# EAGLE design smdkelvin004 (EAGLE 5.03)
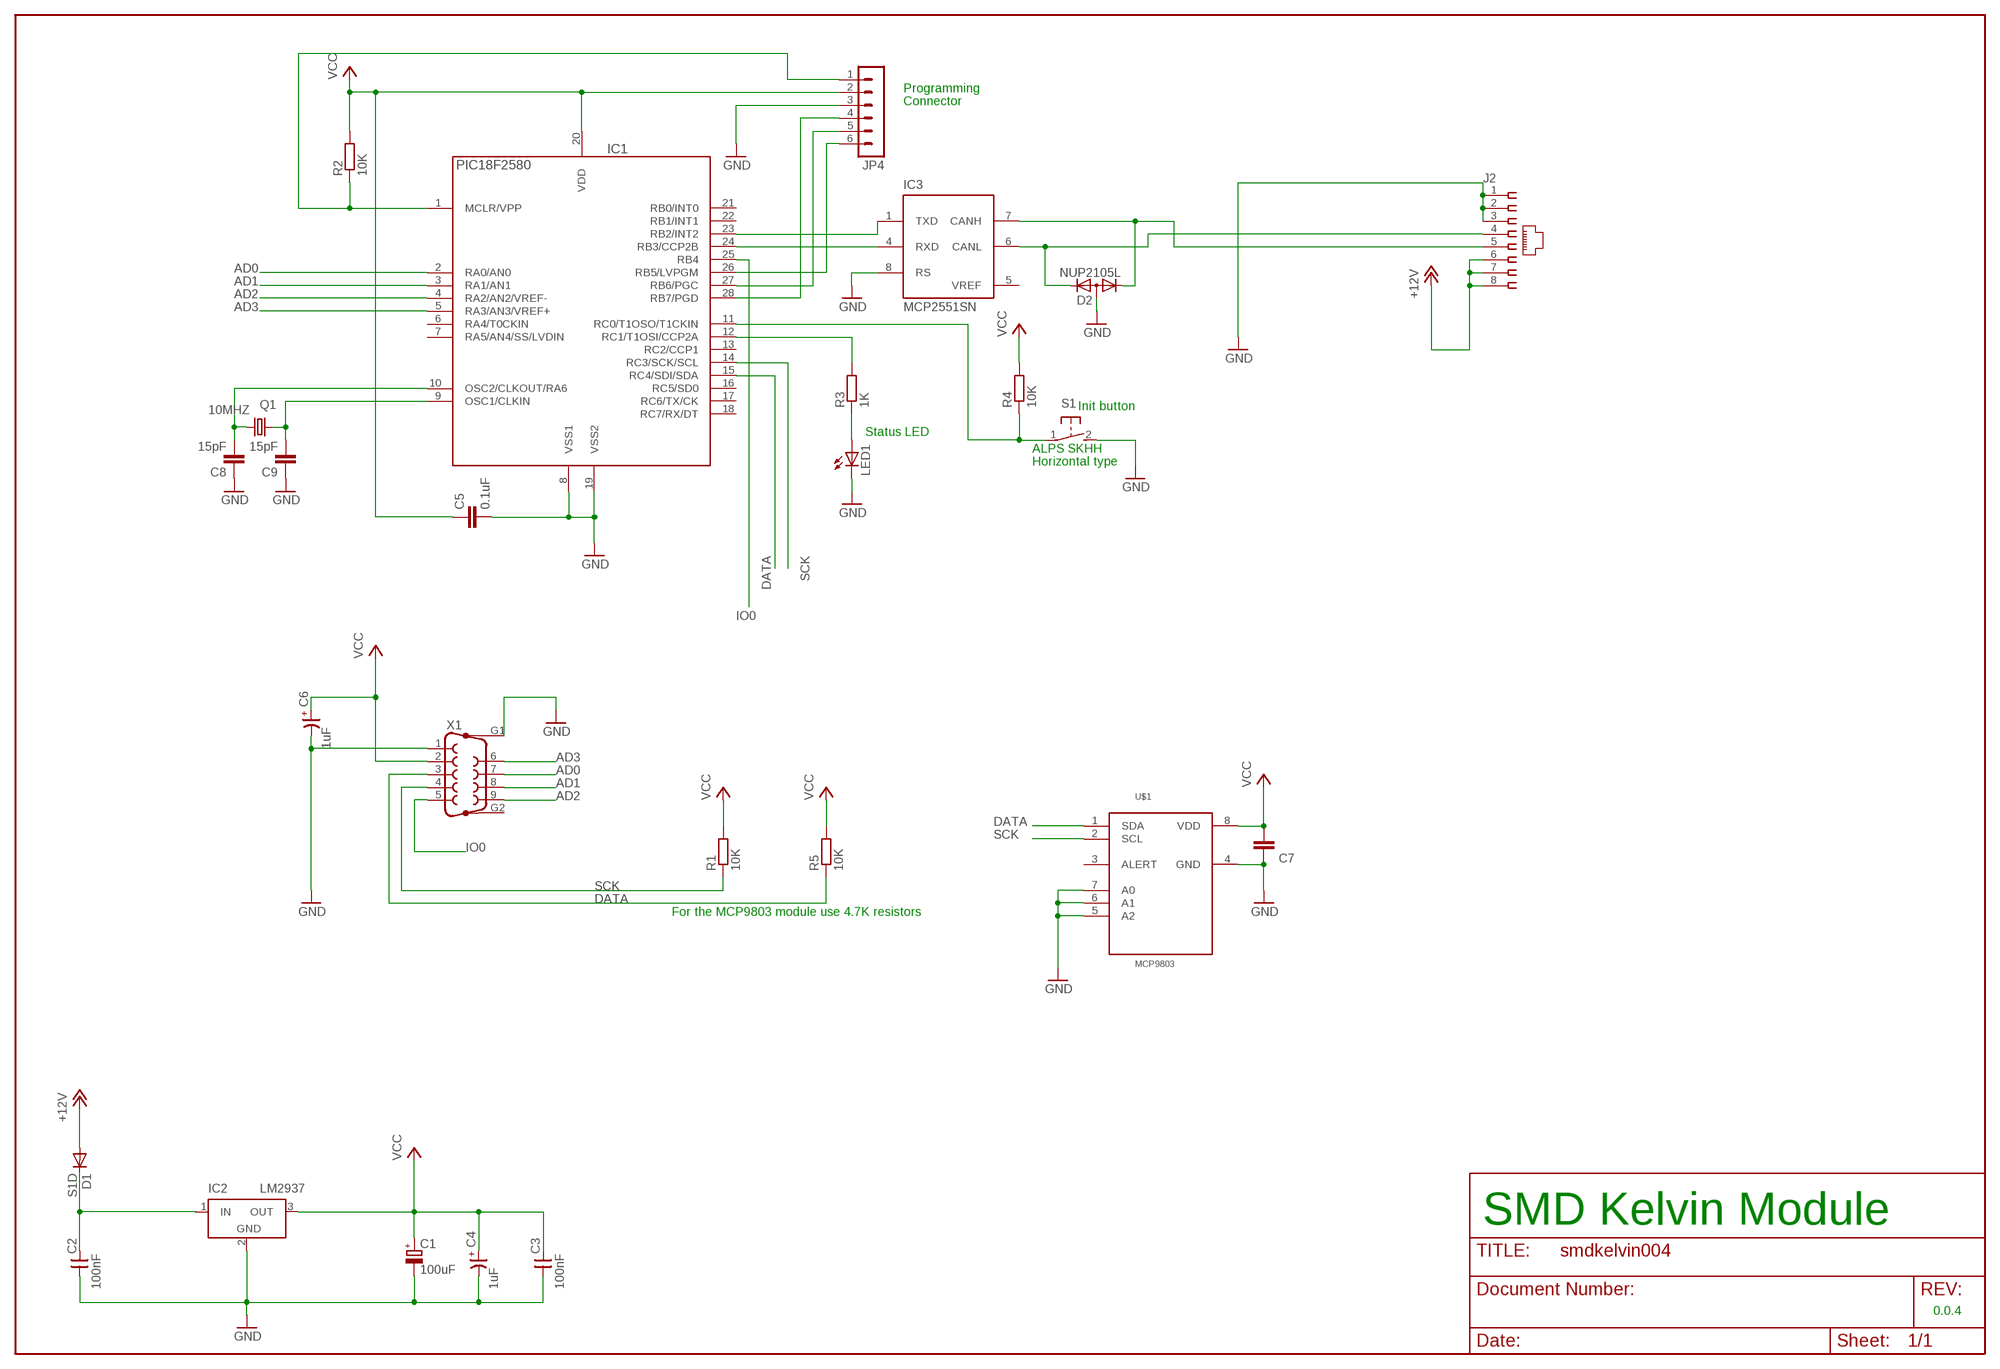
[diagram p0: schematic, sheet 1]

## Parts
C1  100uF  CPOL-EUD  [PANASONIC_D]
C2  100nF  CNP-0805  [0805]
C3  100nF  CNP-0805  [0805]
C4  1uF  CP-SV-A  [SV-A]
C5  0.1uF  C-EUC0805  [C0805]
C6  1uF  CP-SV-A  [SV-A]
C7  0.1uF  C-EUC0805  [C0805]
C8  15pF  C-EUC0805  [C0805]
C9  15pF  C-EUC0805  [C0805]
D1  S1D  DIODE-SMB  [SMB]
D2  NUP2105L  DIODE-2CA|ACSOT23  [SOT23]
IC1  PIC18F2580  PIC18LF252-I/SO  [SO28]
IC2  LM2937  [SOT223]
IC3  MCP2551SN  [SO-08]
J2  520426-4  [520426-4]
JP4  MA06-1  [MA06-1]
LED1  LED3MM  [LED3MM]
Q1  10MHZ  CRYSTALHC49U-H  [HC49U-H]
R1  10K  R-EU_R0805  [R0805]
R2  10K  R-EU_R0805  [R0805]
R3  1K  R-EU_R0805  [R0805]
R4  10K  R-EU_R0805  [R0805]
R5  10K  R-EU_R0805  [R0805]
S1  31-XX  [B3F-31XX]
U$1  MCP9803  [SOIC-8]
X1  F09HP  [F09HP]

## Nets
+12V: D1.A J2.6 J2.7 J2.8
AD0: IC1.2(RA0/AN0) X1.7
AD1: IC1.3(RA1/AN1) X1.8
AD2: IC1.4(RA2/AN2/VREF-) X1.9
AD3: IC1.5(RA3/AN3/VREF+) X1.6
CANH: D2.1(K1) IC3.7(CANH) J2.5
CANL: D2.2(K2) IC3.6(CANL) J2.4
DATA: IC1.15(RC4/SDI/SDA) R5.1 U$1.1(SDA) X1.3
GND: C1.- C2.1 C3.1 C4.- C5.2 C6.- C7.1 C8.1 C9.1 D2.3(A) IC1.8(VSS1) IC1.19(VSS2) IC2.2(GND) IC3.8(RS) J2.1 J2.2 J2.3 JP4.3 LED1.K(C) S1.2(S) U$1.4(GND) U$1.5(A2) U$1.6(A1) U$1.7(A0) X1.1 X1.G1
IO0: IC1.25(RB4) X1.5
N$1: C8.2 IC1.10(OSC2/CLKOUT/RA6) Q1.1
N$2: C2.2 D1.C IC2.1(IN)
N$3: C9.2 IC1.9(OSC1/CLKIN) Q1.2
N$4: IC1.12(RC1/T1OSI/CCP2A) R3.2
N$5: LED1.A R3.1
N$6: IC1.11(RC0/T1OSO/T1CKIN) R4.1 S1.1(P)
N$12: IC1.1(MCLR/VPP) JP4.1 R2.1
N$13: IC1.28(RB7/PGD) JP4.4
N$14: IC1.27(RB6/PGC) JP4.5
N$15: IC1.26(RB5/LVPGM) JP4.6
RXCAN: IC1.24(RB3/CCP2B) IC3.4(RXD)
SCK: IC1.14(RC3/SCK/SCL) R1.1 U$1.2(SCL) X1.4
TXCAN: IC1.23(RB2/INT2) IC3.1(TXD)
VCC: C1.+ C3.2 C4.+ C5.1 C6.+ C7.2 IC1.20(VDD) IC2.3(OUT) JP4.2 R1.2 R2.2 R4.2 R5.2 U$1.8(VDD) X1.2
Unconnected: IC1.6(RA4/T0CKIN) IC1.7(RA5/AN4/SS/LVDIN) IC1.13(RC2/CCP1) IC1.16(RC5/SD0) IC1.17(RC6/TX/CK) IC1.18(RC7/RX/DT) IC1.21(RB0/INT0) IC1.22(RB1/INT1) U$1.3(ALERT) X1.G2

## Notes on the sheet
- Programming
- Connector
- Init button
- Status LED
- ALPS SKHH
- Horizontal type
- For the MCP9803 module use 4.7K resistors
- SMD Kelvin Module
- 0.0.4

## Power pins joined to a net without a drawn wire
GND: IC2.4(GND) IC3.2(VSS)
VCC: IC3.3(VDD)
VREF: IC3.5(VREF)

## Library data of the parts
C1 = rcl:CPOL-EU: POLARIZED CAPACITOR, European symbol
C2 C3 = cap-master:CNP-: NON-POLARIZED CAP
C4 C6 = cap-master:CP-: POLARIZED CAP
C5 C7-C9 = rcl:C-EU: CAPACITOR, European symbol
D1 = diode:DIODE-: DIODE
D2 = diode:DIODE-2CA|AC: Dual DIODE Cathode-Anode|Anode-Cathode
IC1 = pic_olin:PIC18*F252-?: 18F252, 28 pin, 32Kb prog, 1536 data, 256 EEPROM
IC2 = eurosource:LM2937
IC3 = microchip_can:MCP2551: High Speed CAN tranceiver
J2 = con-amp:520426-4: AMP connector
JP4 = con-lstb:MA06-1
LED1 = led:LED: LED OSRAM: - CHIPLED LG R971, LG N971, LY N971, LG Q971, LY Q971, LO R971, LY R971 LH N974, LH R974 LS Q976, LO Q976, LY Q976 LO Q996 - Hyper CHIPLED LW Q18S LB Q993, LB Q99A, LB R99A - SideLED LS A670, LO A670, LY A670, LG A670, LP A670 LB A673, LV A673, LT A673, LW A673 LH A674 LY A675 LS A676, LA A676, LO A676, LY A676, LW A676 LS A679, LY A679, LG A679 - Hyper Micro SIDELED® LS Y876, LA Y876, LO Y876, LY Y876 LT Y87S - SmartLED LW L88C, LW L88S LB L89C, LB L89S, LG L890 LS L89K, LO L89K, LY L89K LS L896, LA L896, LO L896, LY L896 - TOPLED LS T670, LO T670, LY T670, LG T670, LP T670 LSG T670, LSP T670, LSY T670, LOP T670, LYG T670 LG T671, LOG T671, LSG T671 LB T673, LV T673, LT T673, LW T673 LH T674 LS T676, LA T676, LO T676, LY T676, LB T676, LH T676, LSB T676, LW T676 LB T67C, LV T67C, LT T67C, LS T67K, LO T67K, LY T67K, LW E67C LS E67B, LA E67B, LO E67B, LY E67B, LB E67C, LV E67C, LT E67C LW T67C LS T679, LY T679, LG T679 LS T770, LO T770, LY T770, LG T770, LP T770 LB T773, LV T773, LT T773, LW T773 LH T774 LS E675, LA E675, LY E675, LS T675 LS T776, LA T776, LO T776, LY T776, LB T776 LHGB T686 LT T68C, LB T68C - Hyper Mini TOPLED® LB M676 - Mini TOPLED Santana® LG M470 LS M47K, LO M47K, LY M47K Source: http://www.osram.convergy.de/
Q1 = crystal:CRYSTAL: CRYSTAL
R1-R5 = rcl:R-EU_: RESISTOR, European symbol
S1 = switch-omron:31-XX: OMRON SWITCH
U$1 = eurosource_mcp9803:MCP9803
X1 = con-subd:F09HP: SUB-D

## Board
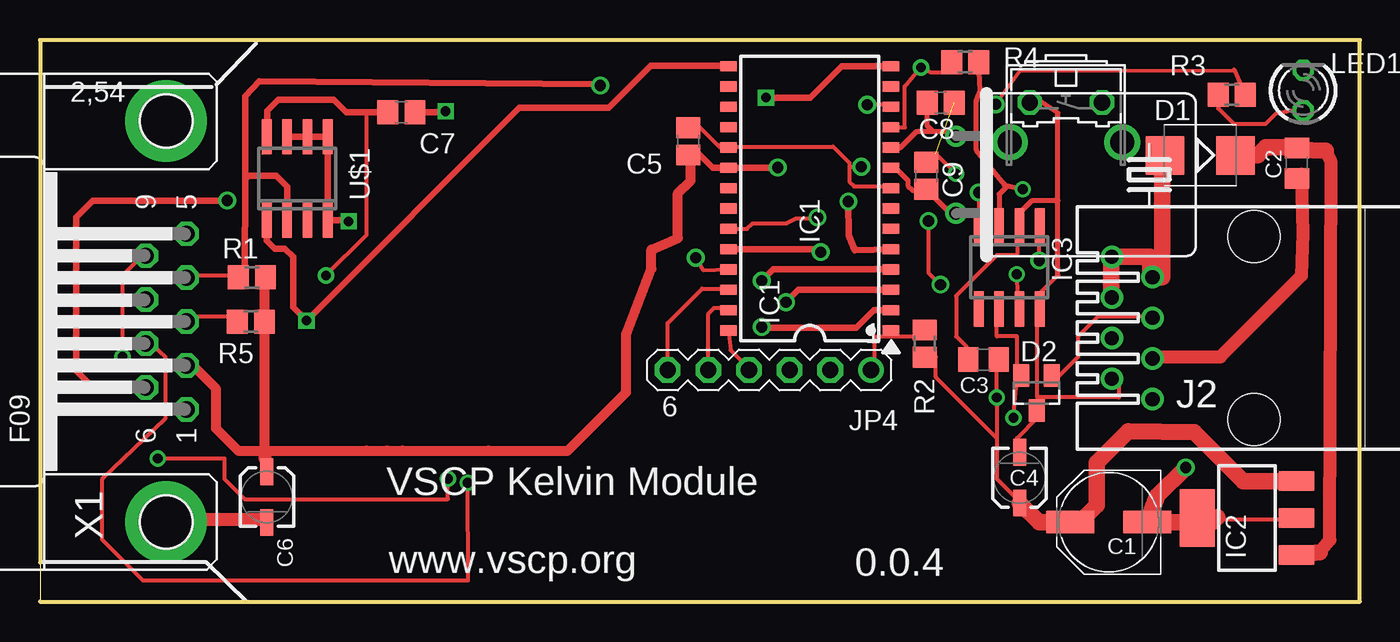
[diagram p1: board, top side]
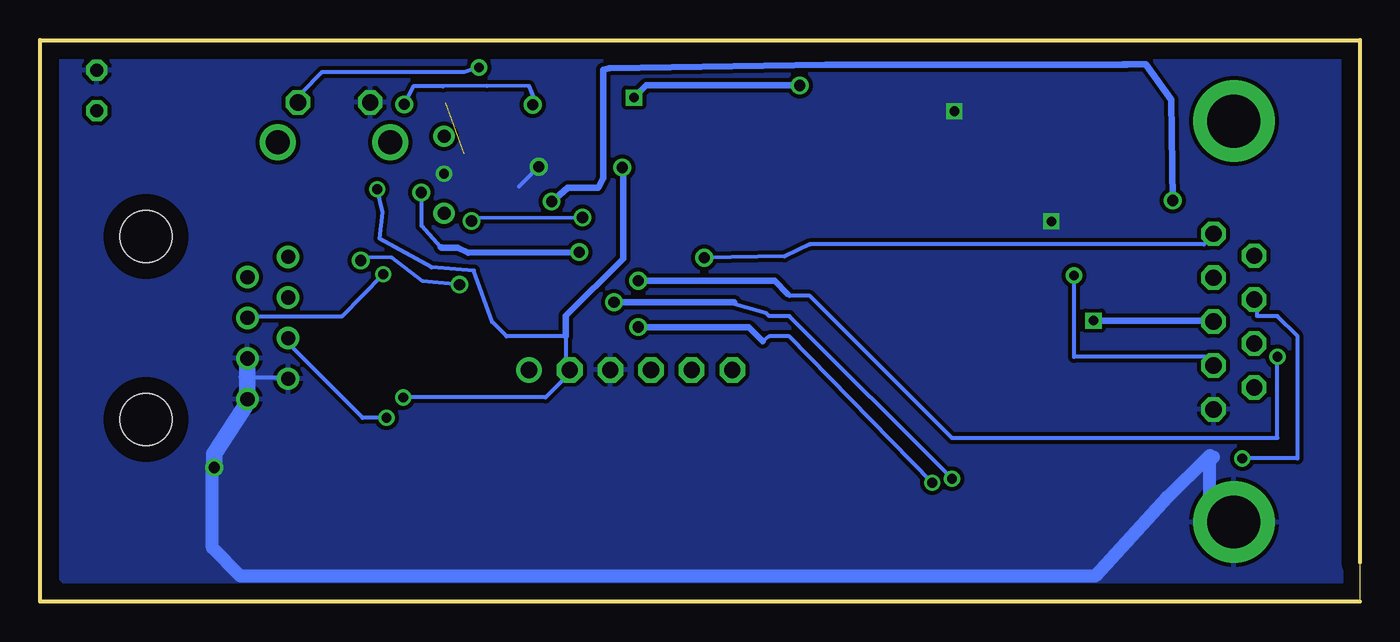
[diagram p2: board, bottom side, seen from below]

Size 82.46 x 35.08 mm. Coordinates in mm from the lower left corner, seen from the top.
Outline: 0,0 82.46,0 82.46,35.08 0,35.08 0,2.45 0,0
Copper layers (1*16): Top 0.035mm / dielectric 1.5mm / Bottom 0.035mm
Design rules "10mils": minimum track width 10mil, minimum drill 24mil, track to track 10mil, track to pad 10mil, pad to pad 10mil, via to via 10mil, smd to smd 10mil, copper to edge 40mil, drill to drill 10mil, minimum pad ring 10mil, minimum via ring 8mil, stop-mask expansion 0mil, vias tented up to drill 0mil, thermal gap 10mil

### Footprints (pad centres in the part's own frame; a part is rotated, then mirrored left to right if it is on the bottom)
PANASONIC_D = smd 3 x 1.4: + 2.4,0; - -2.4,0
0805 = smd 1.27 x 1.524: 1 -0.953,0; 2 0.953,0
SV-A = smd 1.676 x 0.813: + -1.587,0; - 1.587,0
C0805 = smd 1.3 x 1.5: 1 -0.85,0; 2 0.85,0
SMB = smd 2.4 x 2.4: A 2.2,0; C -2.2,0
SOT23 = smd 1 x 1.4: 1 -0.95,-1.1; 2 0.95,-1.1; 3 0,1.1
SO28 = smd 0.635 x 1.016: 1 -8.255,-5.08; 2 -6.985,-5.08; 3 -5.715,-5.08; 4 -4.445,-5.08; 5 -3.175,-5.08; 6 -1.905,-5.08; 7 -0.635,-5.08; 8 0.635,-5.08; 9 1.905,-5.08; 10 3.175,-5.08; 11 4.445,-5.08; 12 5.715,-5.08; 13 6.985,-5.08; 14 8.255,-5.08; 15 8.255,5.08; 16 6.985,5.08; 17 5.715,5.08; 18 4.445,5.08; 19 3.175,5.08; 20 1.905,5.08; 21 0.635,5.08; 22 -0.635,5.08; 23 -1.905,5.08; 24 -3.175,5.08; 25 -4.445,5.08; 26 -5.715,5.08; 27 -6.985,5.08; 28 -8.255,5.08
SOT223 = smd 1.219 x 2.235: 1 -2.311,-3.099; 2 0,-3.099; 3 2.311,-3.099 | smd 3.6 x 2.2: 4 0,3.099
SO-08 = smd 0.6 x 2.2: 1 -1.905,-2.6; 2 -0.635,-2.6; 3 0.635,-2.6; 4 1.905,-2.6; 5 1.905,2.6; 6 0.635,2.6; 7 -0.635,2.6; 8 -1.905,2.6
520426-4 = drill 0.889 round: 1 -4.445,6.35; 2 -3.175,8.89; 3 -1.905,6.35; 4 -0.635,8.89; 5 0.635,6.35; 6 1.905,8.89; 7 3.175,6.35; 8 4.445,8.89 | hole 3.251: -5.715,0; 5.715,0
MA06-1 = drill 1.016 pad 1.6 round: 1 -6.35,0 | drill 1.016 pad 1.6 octagon: 2 -3.81,0; 3 -1.27,0; 4 1.27,0; 5 3.81,0; 6 6.35,0
LED3MM = drill 0.813 octagon: A -1.27,0; K 1.27,0
HC49U-H = drill 0.813 round: 1 -2.413,-5.08; 2 2.413,-5.08
R0805 = smd 1.3 x 1.5: 1 -0.85,0; 2 0.85,0
B3F-31XX = drill 1.016 octagon: 1 -2.261,-1.245; 2 2.261,-1.245 | drill 1.499 pad 2.159 round: 3 -3.505,1.245; 4 3.505,1.245
SOIC-8 = smd 0.6 x 2.2: 1 -1.905,-2.6; 2 -0.635,-2.6; 3 0.635,-2.6; 4 1.905,-2.6; 5 1.905,2.6; 6 0.635,2.6; 7 -0.635,2.6; 8 -1.905,2.6
F09HP = drill 1.016 octagon: 1 -5.486,-1.27; 2 -2.743,-1.27; 3 0,-1.27; 4 2.743,-1.27; 5 5.486,-1.27; 6 -4.115,1.27; 7 -1.372,1.27; 8 1.372,1.27; 9 4.115,1.27 | drill 3.302 pad 5.08 round: G1 -12.522,0; G2 12.522,0

### Placement (x,y rotation side)
C1  66.77,4.96 180 top
C2  78.52,27.38 90 top
C3  58.94,15.11 0 top
C4  61.19,7.74 90 top
C5  40.5,28.75 90 top
C6  14.17,6.53 270 top
C7  22.57,30.57 180 top
C8  56.27,31.17 180 top
C9  55.37,26.6 270 top
D1  72.48,27.87 180 top
D2  62.26,13.03 180 top
IC1  48.09,25.19 90 top
IC2  75.4,5.22 90 top
IC3  60.55,20.88 180 top
J2  75.85,17.09 90 top
JP4  45.56,14.47 180 top
LED1  78.92,31.93 90 top
Q1  62.3,26.66 270 top
R1  13.24,20.25 0 top
R2  55.27,16.12 270 top
R3  74.45,31.66 0 top
R4  57.8,33.7 0 top
R5  13.17,17.49 0 top
S1  64.09,29.94 180 top
U$1  16.07,26.43 0 top
X1  7.88,17.49 90 top

### Tracks (layer width: path | path; a pad name or v marks a point on that pad's centre or on a via)
+12V
  Top 1.016: 66.91,21.54 66.91,21.65 | 66.91,21.54 J2.8 69.37,21.54 69.37,20.27 J2.7 70.12,20.27 70.12,27.87 D1.A | J2.6 66.91,19 66.91,21.54
AD0  (via drill 0.61, 0.7)
  Top 0.254: v26.72,7.42 26.75,1.32 6.43,1.32 3.89,3.86 3.89,7.67 7.84,11.46 7.84,15.27 6.43,16.56 X1.7
  Top 0.406: IC1.2 52.09,18.21 50.99,17.11 45.13,17.11 v45.09,17.15
  Bottom 0.254: v26.72,7.42 35.64,16.56 36.91,16.56 37.32,16.27
  Bottom 0.406: v45.09,17.15 38.2,17.15 37.32,16.27
AD1  (via drill 0.61, 0.7)
  Top 0.254: v7.35,8.94 11.51,8.94 11.51,7.67 12.78,6.4 25.48,6.4 v25.48,7.67
  Top 0.406: IC1.3 47.38,19.48 v46.6,18.7
  Bottom 0.254: v7.35,8.94 3.89,8.94 3.89,16.56 5.16,17.83 6.43,17.83 6.43,19.1 X1.8 | v25.48,7.67 35.64,17.83 36.91,17.83 37.08,18.01 39.53,18.69 39.45,18.7
  Bottom 0.406: 39.08,18.7 39.45,18.7 v46.6,18.7
AD2  (via drill 0.61, 0.7)
  Top 0.254: v5.16,15.29 5.16,20.37 6.43,21.64 X1.9
  Top 0.406: IC1.4 45.8,20.75 v45.09,20.04
  Bottom 0.254: v5.16,15.29 5.16,10.21 25.48,10.21 34.37,19.1 35.64,19.1 35.77,19.24
  Bottom 0.406: v45.09,20.04 36.57,20.04 35.77,19.24
AD3  (via drill 0.7)
  Top 0.406: X1.6 3.31,13.38 2.25,14.43 2.25,24 3.3,25.05 v11.7,25.05 | v50.5,24.99 50.51,22.87 50.91,21.94 53.29,22 53.27,22.02 IC1.5
  Bottom 0.406: v11.7,25.05 11.78,31.35 13.37,33.57 14.79,33.57 14.58,33.53 32.51,33.52 33.37,33.52 46.9,33.33 47.26,33.21 47.26,26.43 47.6,25.85 49.48,25.85 v50.5,24.99
CANH  (via drill 0.61)
  Top 0.254: D2.1 63.58,14.02 64.85,15.29 64.85,16.56 66.12,17.83 69.93,17.83 J2.5 | v61.02,20.45 61.04,19.1 IC3.7
  Bottom 0.254: v61.02,20.45 63.58,17.83 69.93,17.83 J2.5
CANL  (via drill 0.61)
  Top 0.254: 61.04,14.02 61.04,16.56 59.77,16.56 59.77,17.83 IC3.6 | v60.81,11.48 61.04,14.02 | 61.04,14.02 D2.2
  Bottom 0.254: v60.81,11.48 62.31,11.48 67.39,16.56 J2.4
DATA  (via drill 0.6)
  Top 0.254: R5.1 12.78,17.83 8.97,17.83 X1.3
  Top 0.406: IC1.15 | IC1.15 43,33.47 | U$1.1 14.17,22.55 14.66,22.05 15.3,22.05 15.81,21.54 15.81,18.39 v16.65,17.55 29.94,30.84 35.52,30.84 38.14,33.46 IC1.15
  Bottom 0.406: v16.65,17.55 9.21,17.55 X1.3
GND  (via drill 0.6, 0.61, 0.7)  (1 unrouted)
  Top 0.254: 62.31,11.48 61.04,10.21 61.04,8.94 C4.- | 62.31,12.75 62.31,11.48 | 62.31,12.75 62.31,17.83 IC3.8 62.31,19.1 63.58,20.37 | 62.31,11.48 D2.3 | 62.31,12.75 67.39,12.75 67.39,14.02 J2.2 | 43.2,28.48 43.27,28.42 49.54,28.42 50.56,27.4 50.56,27.07 | 43.2,28.48 IC1.19 | 42.44,28.5 43.19,28.5 43.2,28.48 | 42.44,28.5 42.4,28.5 | 50.56,27.07 50.56,26.24 50.86,25.94 53.21,25.94 53.24,25.91 53.27,25.95 IC1.8 | v51.31,27.16 50.65,27.16 50.56,27.07 | IC2.2 77.55,5.13 73.74,5.13 73.23,4.96 | 78.82,26.72 C2.1 | J2.3 69.93,15.29 | 42.44,28.5 42.44,28.4 41.24,29.6 C5.2 40.72,29.26 | 14.05,5.13 C6.- | v57.23,26.72 55.96,27.99 C9.1 | C3.1 58.5,15.29 57.23,16.56 57.23,19.1 59.77,21.64 61.04,21.64 61.04,22.91 IC3.2
  Top 0.305: 63.58,20.37 63.58,25.06 | 63.58,25.06 63.58,30.53 62.4,31.31 S1.2 | 61.18,24.25 61.97,25.03 63.47,25.03 63.5,25.06 63.58,25.06
  Top 0.406: 61.18,24.25 IC3.2 | U$1.7 U$1.6 U$1.5 U$1.4 19.2,23.83 v19.28,23.75 | C7.1 25.28,30.57 v25.34,30.63
  Top 0.813: 78.82,26.72 78.91,22.98 78.82,20.37 73.74,15.29 69.93,15.29 | 14.05,5.13 10.24,5.13 X1.G1
  Top 1.016: v71.58,8.37 69.81,6.6 C1.- 73.03,4.96 72.99,5 IC2.4 72.99,5.2 73.23,4.96 73.53,5.26
  Bottom 0.254: v51.31,27.16 52.53,25.94 | J2.2 67.39,14.02 69.5,14.02 69.93,14.02 | S1.2 62.31,31.28 | v71.58,8.37 71.2,8.94 71.7,8.31
  Bottom 0.813: 71.7,8.31 71.7,3.35 69.94,1.59 16.55,1.59 12.05,6.52 12.18,6.39 9.37,9.13 | 9.37,9.13 9.37,9.08 9.24,8.95 9.15,9.04 | X1.G1 7.9,4.97 9.37,6.44 9.37,9.13
  Bottom 1.016: J2.1 69.5,14.02 J2.3 | J2.1 69.5,12.55 69.52,12.53 | J2.1 69.39,12.65 69.37,12.63 71.58,9.22 v71.58,8.37
  pour Bottom: 0.67,34.09 0.67,1.45 1.26,0.86 80.55,0.86 81.52,1.83 81.52,34.32 81.33,34.3 0.78,34.3 0.82,34.17
IO0  (via drill 0.7)
  Top 0.254: IC1.25 41.45,20.71 v40.96,21.48
  Bottom 0.254: v40.96,21.48 35.95,21.57 34.37,22.31 9.74,22.31 9.07,22.98 | 9.07,22.98 9.06,22.99 | 9.07,22.98 X1.5
N$1
  Top 0.305: IC1.10 53.74,28.37 54.76,29.38 55.77,29.38 | 55.77,29.38 56.91,29.38 Q1.1 | C8.2 55.42,29.73 55.77,29.38
N$2
  Top 0.813: 79.96,3.07 80.58,3.83 80.66,27.47 80.33,28.16
  Top 1.016: D1.C 76.08,27.87 76.58,28.37 78.49,28.37 C2.2 78.64,28.22 80.33,28.16 | IC2.1 79.96,3.07
N$3
  Top 0.305: Q1.2 56.87,24.25 C9.2 55.31,25.69 54.51,25.69 54.21,25.99 54.21,26.31 53.42,27.1 IC1.9
N$4  (via drill 0.7)
  Top 0.254: R3.2 74.59,33.23 74.65,33.19 61.23,33.16 v59.7,31.06 | 53.38,31.03 53.39,31.01 | IC1.12 53.38,31.03 | v51.68,31.03 53.37,31.03 53.38,31.03
  Bottom 0.254: v59.7,31.06 59.14,32.19 57.3,32.19 54.54,32.21 51.9,32.2 51.42,31.06 v51.68,31.03
N$5
  Top 0.254: R3.1 73.6,30.81 74.57,29.84 76.56,29.84 77.24,30.52 77.88,30.64 78.08,30.68 78.24,30.68 LED1.A
N$6  (via drill 0.61)
  Top 0.254: R4.1 57.23,33.07 55.66,33.06 v55.03,33.37 54.02,32.17 54.03,29.62 53.29,29.62 53.35,29.68 IC1.11
  Bottom 0.254: v55.03,33.37 55.96,33.07 64.85,33.07 66.12,31.8 S1.1
N$12
  Top 0.254: 53.64,16.56 52.15,16.56 52.15,14.02 JP4.1 | 53.64,16.56 54.69,16.56 R2.1 | IC1.1 53.3,16.9 53.64,16.56
N$13
  Top 0.254: 44.38,14.47 44.42,14.43 | 44.38,14.47 JP4.4 | IC1.28 43.14,15.71 44.38,14.47
N$14
  Top 0.254: JP4.5 41.75,17.98 42.11,18.34 43.22,18.34 43.2,18.32 IC1.27
N$15
  Top 0.254: JP4.6 39.21,17.4 41.36,19.55 43.07,19.55 43.12,19.6 IC1.26
RXCAN  (via drill 0.7)
  Top 0.254: IC3.4 58.62,23.47 | IC3.4 | v58.64,25.56 IC3.4
  Top 0.406: IC1.24 48.59,22.02 v48.77,21.83
  Bottom 0.254: 57.42,22.12 58.62,23.47 58.62,25.37 v58.64,25.56
  Bottom 0.406: v48.77,21.83 55.71,21.8 56.37,22.1 57.36,22.1 57.38,22.12 57.42,22.12
SCK  (via drill 0.6, 0.7)
  Top 0.254: R1.1 12.78,20.37 8.97,20.37 X1.4
  Top 0.406: 53.15,33.45 IC1.14 50.07,33.44 48.11,31.48 v45.35,31.48 | 12.78,20.37 12.81,26.42 | 12.81,26.42 12.83,31.58 13.69,32.5 34.91,32.33 v35,32.24 | U$1.2 15.44,25.91 14.75,26.59 12.97,26.59 12.81,26.42
  Bottom 0.406: v35,32.24 44.59,32.24 v45.35,31.48
TXCAN  (via drill 0.7)
  Top 0.254: IC1.23 44.16,23.29 44.51,23.63 46.63,23.62 47.25,23.94 48.53,23.94 v48.57,23.99 | v55.5,23.77 55.5,20.55 v56.25,19.8 | IC3.1 62.45,23.45 62.43,23.42 v62.42,21.31
  Bottom 0.254: v48.57,23.99 55.53,23.93 v55.5,23.77 | v56.25,19.8 58.58,20.01 60.5,21.49 62.14,21.51 v62.42,21.31
VCC  (via drill 0.61, 0.7)
  Top 0.254: 59.77,10.21 v59.77,12.75 59.77,15.29 C3.2 | 59.77,10.21 59.77,7.67 61.04,6.4 C4.+ | 59.77,10.21 55.96,14.02 55.96,15.29 R2.2 | 14.05,20.37 R1.2 | 20.4,9.43 20.45,9.36 | 21.67,9.43 21.67,9.29 | 14.05,17.83 R5.2 | 14.05,9.43 14.08,9.3 | 14.05,8.94 C6.+ | 28.02,9.43 28.11,9.38 | v17.86,20.37 20.4,22.91 20.4,30.57
  Top 0.305: v61.4,25.76 60.59,25.92 60.26,26.01 | 60.26,26.01 60.21,26.03 60.42,25.95 59.91,25.45 IC3.3 | R4.2 58.75,31.91 58.49,31.28 58.49,28.2 60.27,26.05 60.26,26.04 60.26,26.01
  Top 0.406: C5.1 41.23,27.9 42.02,27.11 IC1.20 | IC1.20 43.04,27.07 | IC1.20 43.01,27.15 | 43.01,27.15 43,27.16 | v46.09,27.11 43.05,27.11 43.01,27.15 | C7.2 20.4,30.57 19.13,30.57 18.35,31.35 14.88,31.35 14.2,30.67 14.2,28.67 14.03,28.5 14.03,28.89 U$1.8
  Top 0.61: X1.2 9.53,14.75 11,13.28 11,10.8 12.37,9.43 14.05,9.43 | 14.05,9.43 20.4,9.43 21.67,9.43 | 21.67,9.43 28.02,9.43 32.98,9.43 36.62,13.07 36.62,16.71 38.19,20.79 38.19,21.98 39.85,22.71 39.85,25.51 40.64,26.3 40.64,27.8 40.54,27.9 C5.1 | 14.05,20.37 14.05,17.83 14.05,9.43 | 21.67,9.43 22.64,9.43
  Top 0.813: 14.05,9.43 14.05,8.94
  Top 1.016: C4.+ 61.22,6.15 62.41,4.96 C1.+ 65.01,5.01 66.01,6.01 66.01,8.67 67.97,10.63 72.1,10.57 75.16,7.51 IC2.3
  Bottom 0.254: v61.4,25.76 61.05,24.33 61.24,22.68 58,20.87 55.35,20.68 54.22,17.47 53.31,16.56 49.61,16.56 49.61,14.02 | 49.61,14.02 50.88,12.75 v59.77,12.75 | 49.61,14.02 JP4.2 | v17.86,20.37 17.86,15.29 8.97,15.29 X1.2
  Bottom 0.406: 49.61,16.56 49.61,17.85 46.04,21.42 46.04,27.06 v46.09,27.11

### Text on the board
tNames: VSCP Kelvin Module | www.vscp.org | 0.0.4